# Altium project PCB_IHM_MS1.PrjPcb
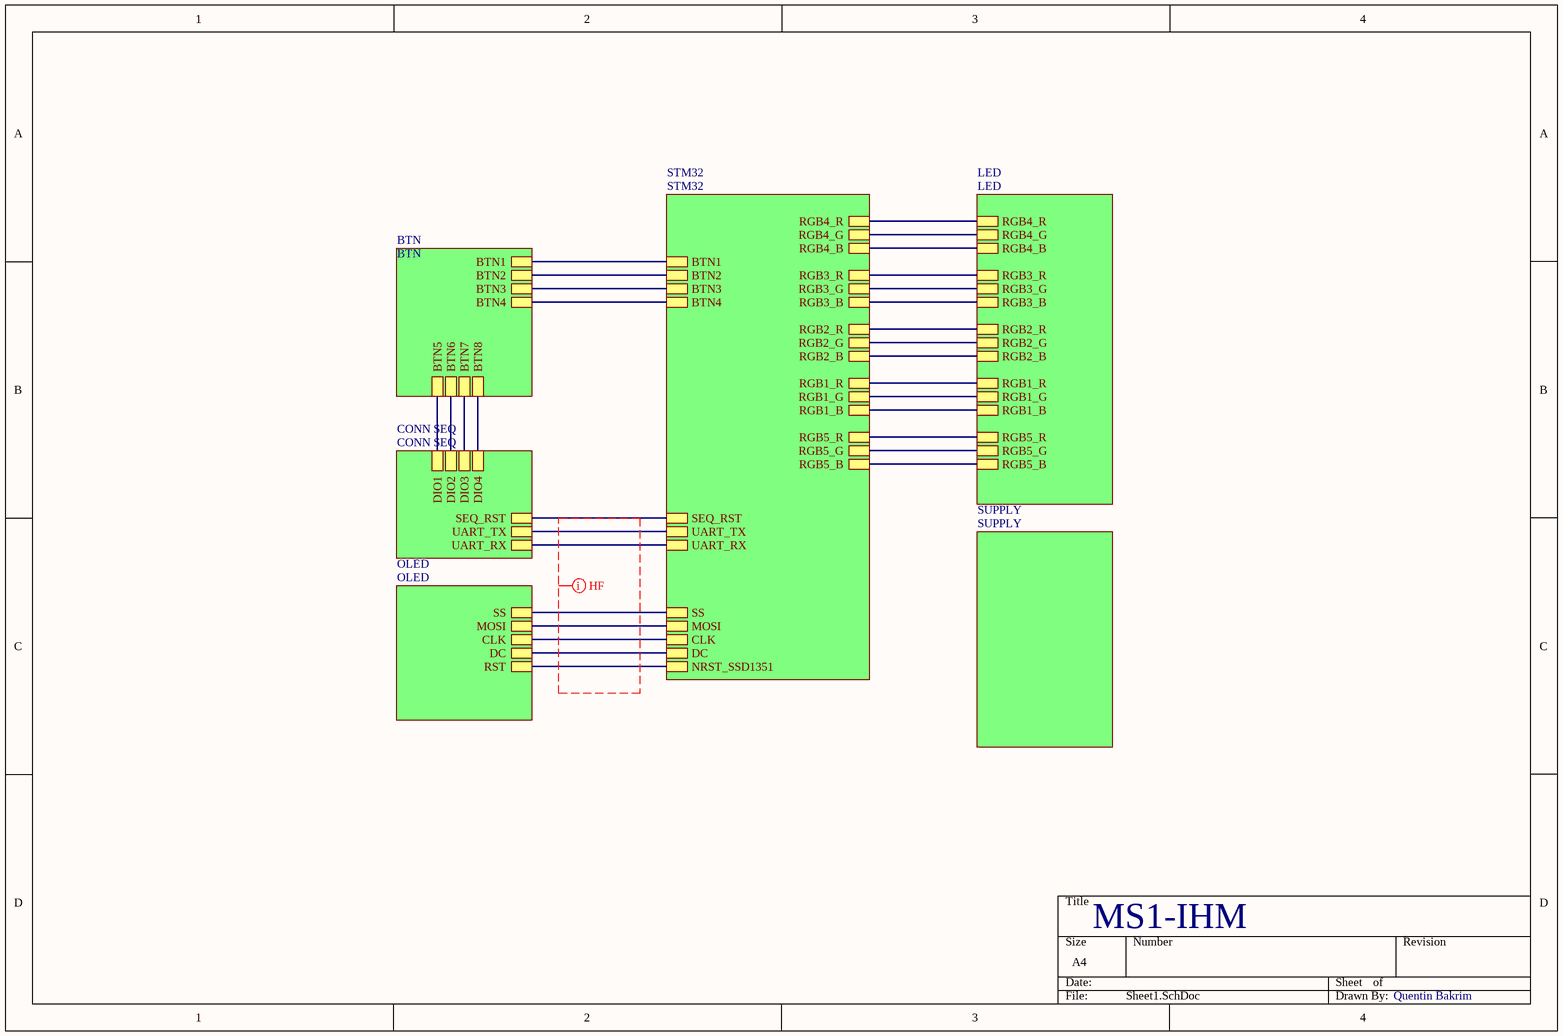
[diagram p0: Sheet1.SchDoc]
7 sheets, 91 parts. Net scope: hierarchical (ports join the sheet entries above them; power ports are global).
Board file: IHM.PcbDoc
Sheets:
  Sheet1.SchDoc
    BTN = BTN.SchDoc
    STM32 = STM32.SchDoc
    LED = LED.SchDoc
    OLED = OLED.SchDoc
    SUPPLY = SUPPLY.SchDoc
    CONN SEQ = CONN SEQ.SchDoc

## Sheet Sheet1.SchDoc
size A4; SheetNumber: 1; SheetTotal: 7

### Sub-sheets
BTN = BTN: BTN6, BTN1, BTN5, BTN4, BTN3, BTN2, BTN7, BTN8
CONN SEQ = CONN SEQ: UART_RX, DIO4, UART_TX, DIO3, DIO2, DIO1, SEQ_RST
LED = LED: RGB4_R, RGB4_B, RGB3_G, RGB5_B, RGB5_R, RGB5_G, RGB4_G, RGB1_B, RGB3_R, RGB1_R, RGB2_G, RGB2_R, RGB1_G, RGB3_B, RGB2_B
OLED = OLED: RST, SS, CLK, DC, MOSI
STM32 = STM32: RGB4_R, RGB4_B, RGB3_G, BTN1, BTN2, RGB5_B, RGB5_R, BTN3, RGB5_G, RGB4_G, BTN4, UART_RX, RGB1_B, RGB3_R, RGB1_R, RGB2_G, UART_TX, RGB2_R, RGB1_G, RGB3_B, RGB2_B, SS, MOSI, CLK, DC, NRST_SSD1351, SEQ_RST
SUPPLY = SUPPLY: no entries

### Nets
NetC1_1: sheet BTN/BTN1, sheet STM32/BTN1
NetC2_1: sheet BTN/BTN3, sheet STM32/BTN3
NetC3_1: sheet BTN/BTN5, sheet CONN SEQ/DIO1
NetC4_1: sheet BTN/BTN2, sheet STM32/BTN2
NetC5_1: sheet BTN/BTN4, sheet STM32/BTN4
NetC6_1: sheet BTN/BTN6, sheet CONN SEQ/DIO2
NetC7_1: sheet BTN/BTN7, sheet CONN SEQ/DIO3
NetC8_1: sheet BTN/BTN8, sheet CONN SEQ/DIO4
NetP1_3: sheet STM32/MOSI, sheet OLED/MOSI
NetP1_4: sheet STM32/CLK, sheet OLED/CLK
NetP1_5: sheet STM32/SS, sheet OLED/SS
NetP1_6: sheet STM32/DC, sheet OLED/DC
NetP1_7: sheet STM32/NRST_SSD1351, sheet OLED/RST
NetP2_6: sheet STM32/UART_TX, sheet CONN SEQ/UART_TX
NetP2_8: sheet STM32/UART_RX, sheet CONN SEQ/UART_RX
NetP2_10: sheet STM32/SEQ_RST, sheet CONN SEQ/SEQ_RST
NetR31_1: sheet STM32/RGB1_B, sheet LED/RGB1_B
NetR32_1: sheet STM32/RGB1_R, sheet LED/RGB1_R
NetR33_1: sheet STM32/RGB1_G, sheet LED/RGB1_G
NetR34_1: sheet STM32/RGB2_B, sheet LED/RGB2_B
NetR35_1: sheet STM32/RGB2_R, sheet LED/RGB2_R
NetR36_1: sheet STM32/RGB2_G, sheet LED/RGB2_G
NetR37_1: sheet STM32/RGB3_B, sheet LED/RGB3_B
NetR38_1: sheet STM32/RGB3_R, sheet LED/RGB3_R
NetR39_1: sheet STM32/RGB3_G, sheet LED/RGB3_G
NetR40_1: sheet STM32/RGB4_B, sheet LED/RGB4_B
NetR41_1: sheet STM32/RGB4_R, sheet LED/RGB4_R
NetR42_1: sheet STM32/RGB4_G, sheet LED/RGB4_G
NetR43_1: sheet STM32/RGB5_B, sheet LED/RGB5_B
NetR44_1: sheet STM32/RGB5_R, sheet LED/RGB5_R
NetR45_1: sheet STM32/RGB5_G, sheet LED/RGB5_G

### Layout directives
net class HF: (no net found under the mark)

### Notes on the sheet
- MS1-IHM
- Quentin Bakrim

## Sheet BTN.SchDoc
size A3; SheetNumber: 2; SheetTotal: 7
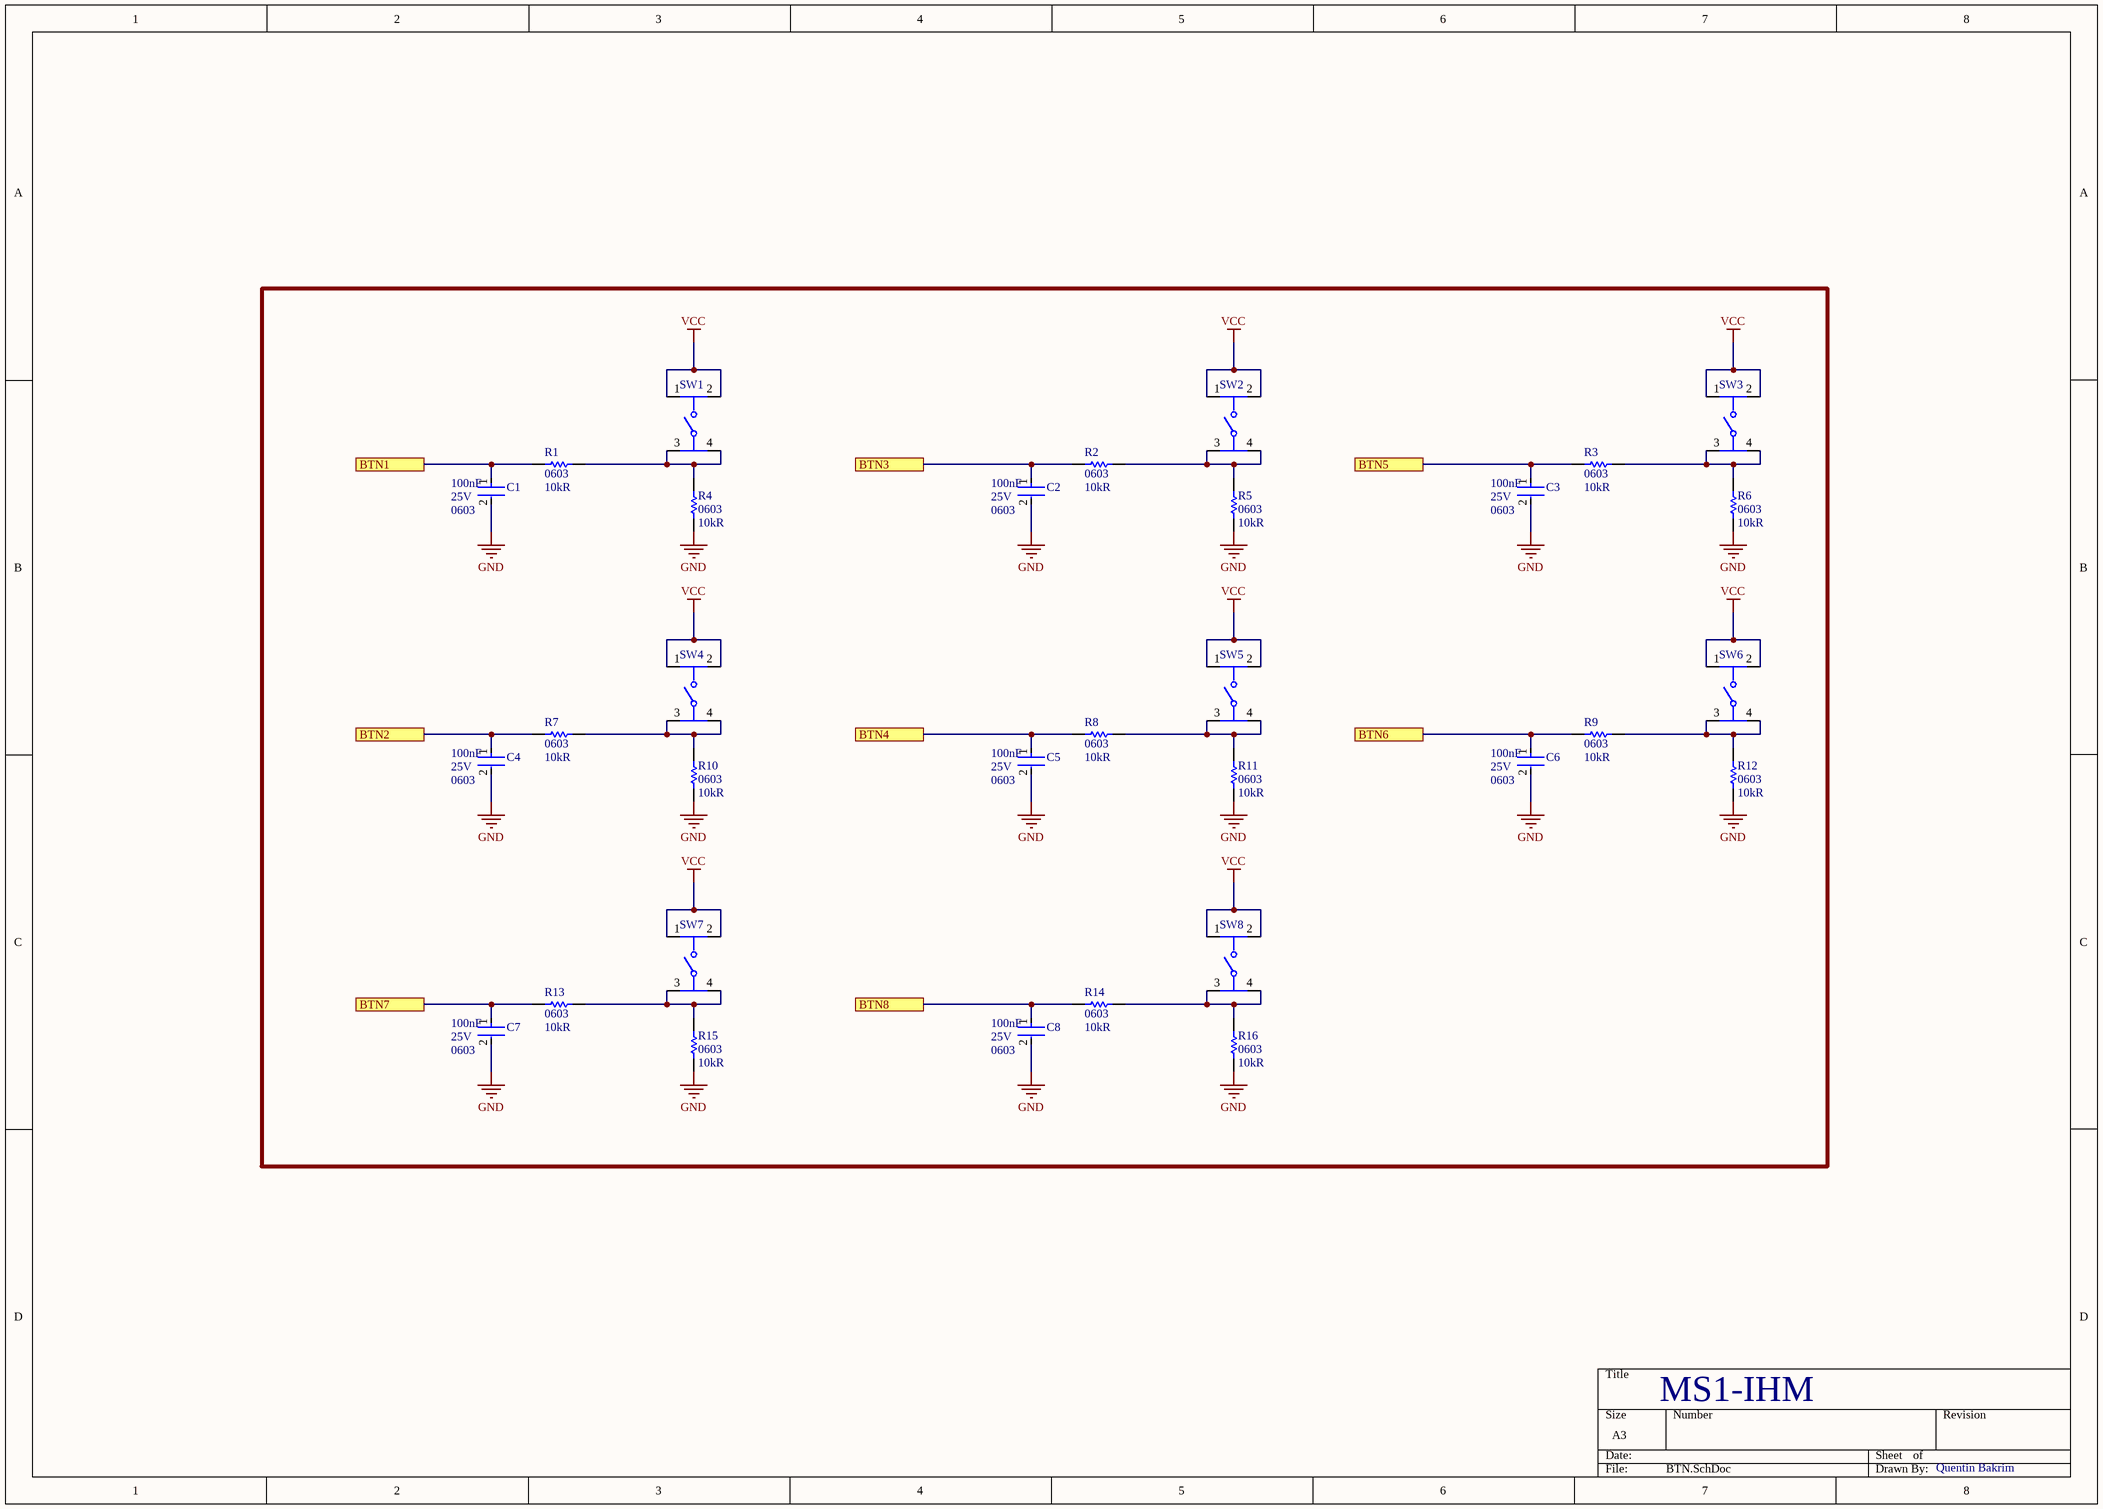
[diagram p1: BTN.SchDoc]

### Parts
C1  Case/Package: 0603  Voltage Rating (DC): 25V  Capacitance: 100nF  [FP-CGA3E-0_3-0_1-MFG]  (hidden comment: CGA3E2X7R1E104K080AA)
C2  Case/Package: 0603  Voltage Rating (DC): 25V  Capacitance: 100nF  [FP-CGA3E-0_3-0_1-MFG]  (hidden comment: CGA3E2X7R1E104K080AA)
C3  Case/Package: 0603  Voltage Rating (DC): 25V  Capacitance: 100nF  [FP-CGA3E-0_3-0_1-MFG]  (hidden comment: CGA3E2X7R1E104K080AA)
C4  Case/Package: 0603  Voltage Rating (DC): 25V  Capacitance: 100nF  [FP-CGA3E-0_3-0_1-MFG]  (hidden comment: CGA3E2X7R1E104K080AA)
C5  Case/Package: 0603  Voltage Rating (DC): 25V  Capacitance: 100nF  [FP-CGA3E-0_3-0_1-MFG]  (hidden comment: CGA3E2X7R1E104K080AA)
C6  Case/Package: 0603  Voltage Rating (DC): 25V  Capacitance: 100nF  [FP-CGA3E-0_3-0_1-MFG]  (hidden comment: CGA3E2X7R1E104K080AA)
C7  Case/Package: 0603  Voltage Rating (DC): 25V  Capacitance: 100nF  [FP-CGA3E-0_3-0_1-MFG]  (hidden comment: CGA3E2X7R1E104K080AA)
C8  Case/Package: 0603  Voltage Rating (DC): 25V  Capacitance: 100nF  [FP-CGA3E-0_3-0_1-MFG]  (hidden comment: CGA3E2X7R1E104K080AA)
R1  Case\/Package: 0603  Resistance: 10kR  [RESC1609X55X30LL15T15]  (hidden comment: ERJ3EKF1002V)
R2  Case\/Package: 0603  Resistance: 10kR  [RESC1609X55X30LL15T15]  (hidden comment: ERJ3EKF1002V)
R3  Case\/Package: 0603  Resistance: 10kR  [RESC1609X55X30LL15T15]  (hidden comment: ERJ3EKF1002V)
R4  Case\/Package: 0603  Resistance: 10kR  [RESC1609X55X30LL15T15]  (hidden comment: ERJ3EKF1002V)
R5  Case\/Package: 0603  Resistance: 10kR  [RESC1609X55X30LL15T15]  (hidden comment: ERJ3EKF1002V)
R6  Case\/Package: 0603  Resistance: 10kR  [RESC1609X55X30LL15T15]  (hidden comment: ERJ3EKF1002V)
R7  Case\/Package: 0603  Resistance: 10kR  [RESC1609X55X30LL15T15]  (hidden comment: ERJ3EKF1002V)
R8  Case\/Package: 0603  Resistance: 10kR  [RESC1609X55X30LL15T15]  (hidden comment: ERJ3EKF1002V)
R9  Case\/Package: 0603  Resistance: 10kR  [RESC1609X55X30LL15T15]  (hidden comment: ERJ3EKF1002V)
R10  Case\/Package: 0603  Resistance: 10kR  [RESC1609X55X30LL15T15]  (hidden comment: ERJ3EKF1002V)
R11  Case\/Package: 0603  Resistance: 10kR  [RESC1609X55X30LL15T15]  (hidden comment: ERJ3EKF1002V)
R12  Case\/Package: 0603  Resistance: 10kR  [RESC1609X55X30LL15T15]  (hidden comment: ERJ3EKF1002V)
R13  Case\/Package: 0603  Resistance: 10kR  [RESC1609X55X30LL15T15]  (hidden comment: ERJ3EKF1002V)
R14  Case\/Package: 0603  Resistance: 10kR  [RESC1609X55X30LL15T15]  (hidden comment: ERJ3EKF1002V)
R15  Case\/Package: 0603  Resistance: 10kR  [RESC1609X55X30LL15T15]  (hidden comment: ERJ3EKF1002V)
R16  Case\/Package: 0603  Resistance: 10kR  [RESC1609X55X30LL15T15]  (hidden comment: ERJ3EKF1002V)
SW1  PTS645SM43SMTR92LFS  [FP-PTS645SM43SMTR92LFS-MFG]  (value not drawn)
SW2  PTS645SM43SMTR92LFS  [FP-PTS645SM43SMTR92LFS-MFG]  (value not drawn)
SW3  PTS645SM43SMTR92LFS  [FP-PTS645SM43SMTR92LFS-MFG]  (value not drawn)
SW4  PTS645SM43SMTR92LFS  [FP-PTS645SM43SMTR92LFS-MFG]  (value not drawn)
SW5  PTS645SM43SMTR92LFS  [FP-PTS645SM43SMTR92LFS-MFG]  (value not drawn)
SW6  PTS645SM43SMTR92LFS  [FP-PTS645SM43SMTR92LFS-MFG]  (value not drawn)
SW7  PTS645SM43SMTR92LFS  [FP-PTS645SM43SMTR92LFS-MFG]  (value not drawn)
SW8  PTS645SM43SMTR92LFS  [FP-PTS645SM43SMTR92LFS-MFG]  (value not drawn)

### Ports
BTN1, BTN2, BTN3, BTN4, BTN5, BTN6, BTN7, BTN8

### Nets
GND: C1.2 C2.2 C3.2 C4.2 C5.2 C6.2 C7.2 C8.2 R4.1 R5.1 R6.1 R10.1 R11.1 R12.1 R15.1 R16.1
VCC: SW1.1 SW1.2 SW2.1 SW2.2 SW3.1 SW3.2 SW4.1 SW4.2 SW5.1 SW5.2 SW6.1 SW6.2 SW7.1 SW7.2 SW8.1 SW8.2
NetC1_1: C1.1 R1.2 ; port BTN1
NetC2_1: C2.1 R2.2 ; port BTN3
NetC3_1: C3.1 R3.2 ; port BTN5
NetC4_1: C4.1 R7.2 ; port BTN2
NetC5_1: C5.1 R8.2 ; port BTN4
NetC6_1: C6.1 R9.2 ; port BTN6
NetC7_1: C7.1 R13.2 ; port BTN7
NetC8_1: C8.1 R14.2 ; port BTN8
NetR1_1: R1.1 R4.2 SW1.3 SW1.4
NetR2_1: R2.1 R5.2 SW2.3 SW2.4
NetR3_1: R3.1 R6.2 SW3.3 SW3.4
NetR7_1: R7.1 R10.2 SW4.3 SW4.4
NetR8_1: R8.1 R11.2 SW5.3 SW5.4
NetR9_1: R9.1 R12.2 SW6.3 SW6.4
NetR13_1: R13.1 R15.2 SW7.3 SW7.4
NetR14_1: R14.1 R16.2 SW8.3 SW8.4

### Notes on the sheet
- MS1-IHM
- Quentin Bakrim

### Library data of the parts
C1-C8 = CMP-08246-002186-1: Cap Ceramic 100nF 25V X7R 10% Pad SMD 0603 +125°C Automotive T/R; Manufacturer: TDK; Composition: Ceramic; Dielectric: X7R; Ratings: AEC-Q200; Length: 1.6mm; REACH SVHC: No SVHC; Width: 0.031inch; Packaging: Tape and Reel; Height: 0.8mm; Termination: SMD/SMT; Max Operating Temperature: 125°C; Thickness: 0.035inch; Case Code (Metric): 1608; Lead Free: Lead Free; Mount: Surface Mount; Voltage Rating: 25V; Tolerance: 10%; Weight: 7.1E-05oz; Min Operating Temperature: -55°C; Package Quantity: 1; Depth: 0.8mm; Case Code (Imperial): 0603; Supplier 1: Digi-Key; Supplier Part Number 1: 445-5667-1-ND; Manufacturer Part Number: CGA3E2X7R1E104K080AA; RoHS: Yes; Category: Ceramic Capacitors; Stock 1: 436091; Pricing 1: 1=0,10000, 10=0,05400, 50=0,02960, 100=0,02430, 500=0,01732, 1000=0,01361 (USD); Series: CGA; Resistor Type: Ceramic; RoHS Compliant: Yes; ComponentLink1URL: https://datasheet.ciiva.com/24220/cga3e2x7r1e104k080aa-265934-24220022.pdf?src-supplier=Mouser; ComponentLink1Description: https://datasheet.ciiva.com/24220/cga3e2x7r1e104k080aa-265934-24220022.pdf?src-supplier=Mouser; ComponentLink2URL: https://datasheet.ciiva.com/22725/1735392-22725638.pdf?src-supplier=Element14; ComponentLink2Description: https://datasheet.ciiva.com/22725/1735392-22725638.pdf?src-supplier=Element14; ComponentLink3URL: https://datasheet.ciiva.com/22725/1735392-22725639.pdf?src-supplier=Element14; ComponentLink3Description: https://datasheet.ciiva.com/22725/1735392-22725639.pdf?src-supplier=Element14; ComponentLink4URL: https://datasheet.ciiva.com/16427/mlccspec-automotive-general-midvoltage-en-16427320.pdf?src-supplier=Future+Electronics; ComponentLink4Description: https://datasheet.ciiva.com/16427/mlccspec-automotive-general-midvoltage-en-16427320.pdf?src-supplier=Future+Electronics; ComponentLink5URL: https://datasheet.ciiva.com/23803/1735392-23803082.pdf?src-supplier=Newark; ComponentLink5Description: https://datasheet.ciiva.com/23803/1735392-23803082.pdf?src-supplier=Newark
R1-R16 = CMP-1012-00623-3: Chip Resistor, 10 KOhm, +/- 1%, 0.1 W, -55 to 155 degC, 0603 (1608 Metric), RoHS, Tape and Reel; Manufacturer: Panasonic; Voltage Rating: 75V; Power Rating: 100mW; Temperature Coefficient: 100ppm\/degreesC; Number of Pins: 2; Package Reference: 603; Depth: 0.8mm; Mount: SurfaceMount; Package Description: 2-Pin Surface Mount Device, Body 1.6 x 0.85 mm; Datasheet Version: 02/2017; Length: 1.6mm; Lead Free: LeadFree; Height: 0.45mm; Number of Terminations: 2; Max Power Dissipation: 100mW; Min Operating Temperature: -55degC; Datasheet URL: https://industrial.panasonic.com/cdbs/www-data/pdf/RDA0000/AOA0000C304.pdf; Termination: SMD/SMT; Case Code (Metric): 1608; Case Code (Imperial): 0603; Tolerance: 1%; Max Operating Temperature: 155degC; RoHSCompliant: true; Voltage Rating (DC): 75V; Radiation Hardening: No; Packaging: TapeandReel; Composition: ThickFilm; Mounting Technology: SurfaceMount; Manufacturer URL: http://www.panasonic.com/; Width: 0.031inch; REACH SVHC: NoSVHC; Contact Plating: Tin; Military Standard: Not; Package Quantity: 1
SW1-SW8 = CMP-2000-05160-2: Contact Resistance: 100mR; Throw Configuration: SPST; Illumination Type: Non-Illuminated; Mechanical Life: 100000Cycles; Voltage Rating (DC): 12V; Current Rating: 50mA; Switch Function: Off-Mom; Actuator Length: 0.85mm; Actuator Material: Nylon; Actuator Type: Standard; Operating Force: 160gf; Min Operating Temperature: -20°C; REACH SVHC: No SVHC; Termination: Gull Wing; Case/Package: SMD/SMT; Packaging: Tape and Reel; Mount: Surface Mount; Orientation: Straight; Lead Free: Lead Free; Contact Material: Silver; Color: Black; Max Current Rating: 50mA; Contact Plating: Silver; Depth: 9mm; Package Quantity: 1; Max Voltage Rating (DC): 12V; Length: 6mm; Max Operating Temperature: 60°C

## Sheet STM32.SchDoc
size A3; SheetNumber: 3; SheetTotal: 7
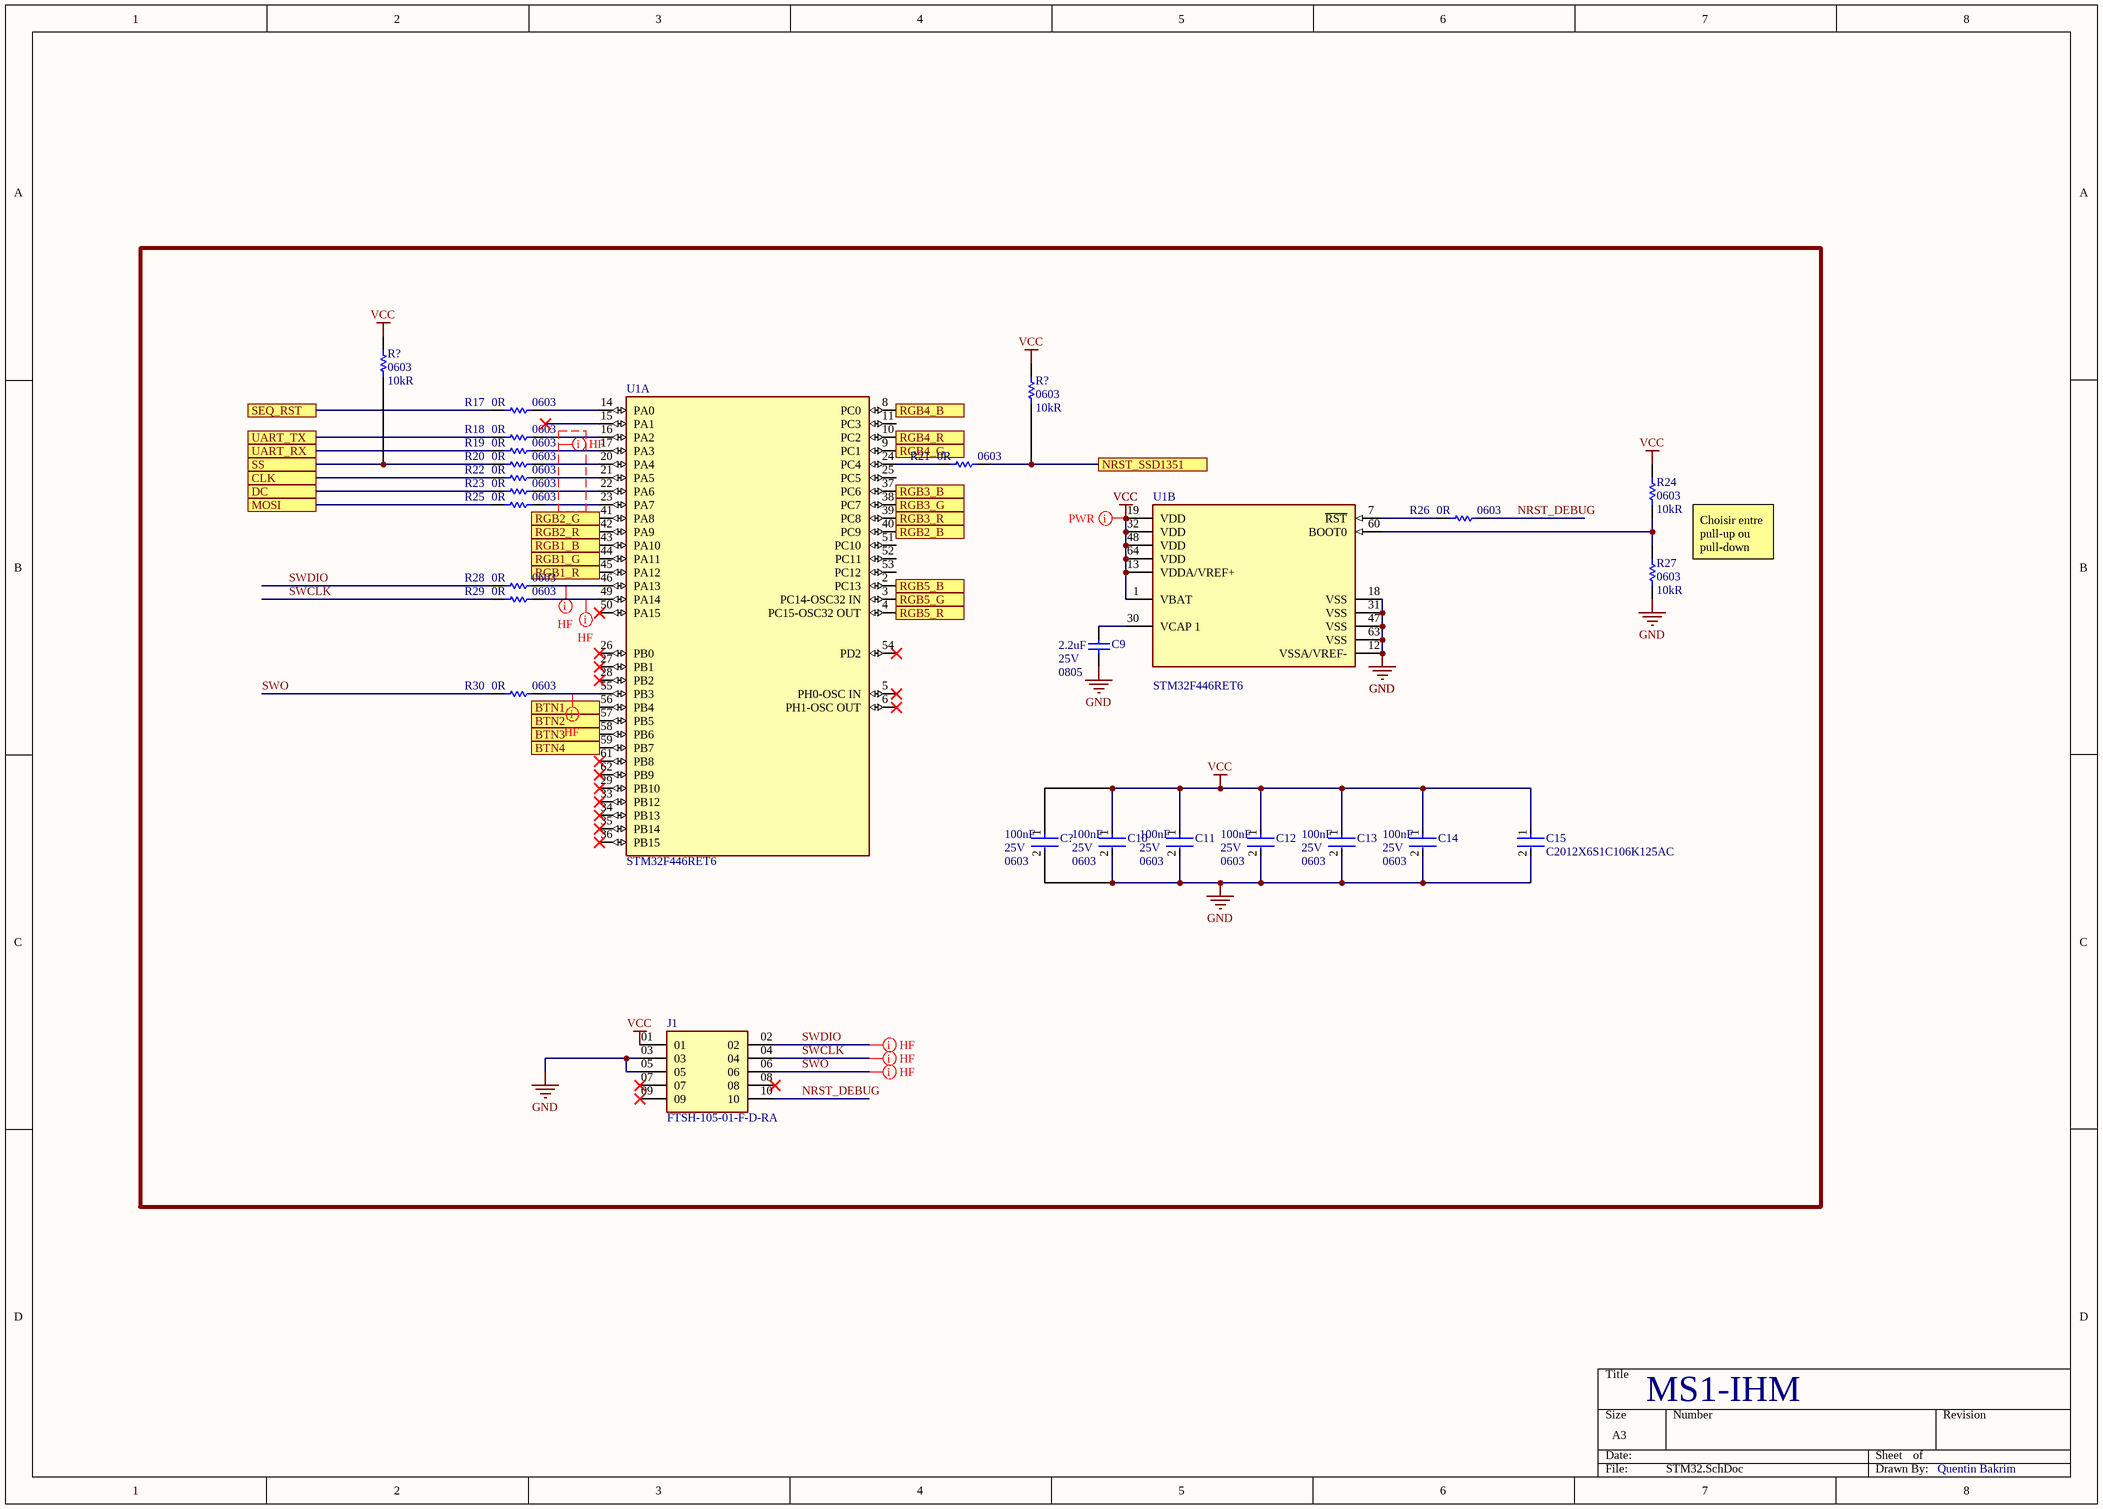
[diagram p2: STM32.SchDoc]

### Parts
(Parts that share a designator on the sheet are numbered #1, #2 ... from top to bottom, then left to right.)
C9  Case/Package: 0805  Capacitance: 2.2uF  Voltage Rating: 25V  [CAPC2013X140X45NL15T25]  (hidden comment: GRM21BR71E225KA73L)
C10  Case/Package: 0603  Voltage Rating (DC): 25V  Capacitance: 100nF  [FP-CGA3E-0_3-0_1-MFG]  (hidden comment: CGA3E2X7R1E104K080AA)
C11  Case/Package: 0603  Voltage Rating (DC): 25V  Capacitance: 100nF  [FP-CGA3E-0_3-0_1-MFG]  (hidden comment: CGA3E2X7R1E104K080AA)
C12  Case/Package: 0603  Voltage Rating (DC): 25V  Capacitance: 100nF  [FP-CGA3E-0_3-0_1-MFG]  (hidden comment: CGA3E2X7R1E104K080AA)
C13  Case/Package: 0603  Voltage Rating (DC): 25V  Capacitance: 100nF  [FP-CGA3E-0_3-0_1-MFG]  (hidden comment: CGA3E2X7R1E104K080AA)
C14  Case/Package: 0603  Voltage Rating (DC): 25V  Capacitance: 100nF  [FP-CGA3E-0_3-0_1-MFG]  (hidden comment: CGA3E2X7R1E104K080AA)
C15  C2012X6S1C106K125AC  [FP-C2012-125-0_2-MFG]
C?  Case/Package: 0603  Voltage Rating (DC): 25V  Capacitance: 100nF  [FP-CGA3E-0_3-0_1-MFG]  (hidden comment: CGA3E2X7R1E104K080AA)
J1  FTSH-105-01-F-D-RA  [SAMTEC_FTSH-105-01-F-D-RA]
R17  PackageReference: 0603  Resistor: 0R  [RESC1609X50X30NL8T20]  (hidden comment: CRCW06030000Z0EA)
R18  PackageReference: 0603  Resistor: 0R  [RESC1609X50X30NL8T20]  (hidden comment: CRCW06030000Z0EA)
R19  PackageReference: 0603  Resistor: 0R  [RESC1609X50X30NL8T20]  (hidden comment: CRCW06030000Z0EA)
R20  PackageReference: 0603  Resistor: 0R  [RESC1609X50X30NL8T20]  (hidden comment: CRCW06030000Z0EA)
R21  PackageReference: 0603  Resistor: 0R  [RESC1609X50X30NL8T20]  (hidden comment: CRCW06030000Z0EA)
R22  PackageReference: 0603  Resistor: 0R  [RESC1609X50X30NL8T20]  (hidden comment: CRCW06030000Z0EA)
R23  PackageReference: 0603  Resistor: 0R  [RESC1609X50X30NL8T20]  (hidden comment: CRCW06030000Z0EA)
R24  Case\/Package: 0603  Resistance: 10kR  [RESC1609X55X30LL15T15]  (hidden comment: ERJ3EKF1002V)
R25  PackageReference: 0603  Resistor: 0R  [RESC1609X50X30NL8T20]  (hidden comment: CRCW06030000Z0EA)
R26  PackageReference: 0603  Resistor: 0R  [RESC1609X50X30NL8T20]  (hidden comment: CRCW06030000Z0EA)
R27  Case\/Package: 0603  Resistance: 10kR  [RESC1609X55X30LL15T15]  (hidden comment: ERJ3EKF1002V)
R28  PackageReference: 0603  Resistor: 0R  [RESC1609X50X30NL8T20]  (hidden comment: CRCW06030000Z0EA)
R29  PackageReference: 0603  Resistor: 0R  [RESC1609X50X30NL8T20]  (hidden comment: CRCW06030000Z0EA)
R30  PackageReference: 0603  Resistor: 0R  [RESC1609X50X30NL8T20]  (hidden comment: CRCW06030000Z0EA)
R?#1  Case\/Package: 0603  Resistance: 10kR  [RESC1609X55X30LL15T15]  (hidden comment: ERJ3EKF1002V)
R?#2  Case\/Package: 0603  Resistance: 10kR  [RESC1609X55X30LL15T15]  (hidden comment: ERJ3EKF1002V)
U1  STM32F446RET6  [FP-LQFP64-5W-MFG]  (parts A,B of 2)

### Ports
BTN1, BTN2, BTN3, BTN4, CLK, DC, MOSI, NRST_SSD1351, RGB1_B, RGB1_G, RGB1_R, RGB2_B, RGB2_G, RGB2_R, RGB3_B, RGB3_G, RGB3_R, RGB4_B, RGB4_G, RGB4_R, RGB5_B, RGB5_G, RGB5_R, SEQ_RST, SS, UART_RX, UART_TX

### Nets
GND: C9.1 C10.2 C11.2 C12.2 C13.2 C14.2 C15.2 C?.2 J1.03 J1.05 R27.1 U1.12(VSSA/VREF-) U1.18(VSS) U1.31(VSS) U1.47(VSS) U1.63(VSS)
VCC: C10.1 C11.1 C12.1 C13.1 C14.1 C15.1 C?.1 J1.01 R24.2 R?#1.2 R?#2.2 U1.1(VBAT) U1.13(VDDA/VREF+) U1.19(VDD) U1.32(VDD) U1.48(VDD) U1.64(VDD)
NRST_DEBUG: J1.10 R26.2
SWCLK: J1.04 R29.1
SWDIO: J1.02 R28.1
SWO: J1.06 R30.1
NetC1_1: U1.56(PB4) ; port BTN1
NetC2_1: U1.58(PB6) ; port BTN3
NetC4_1: U1.57(PB5) ; port BTN2
NetC5_1: U1.59(PB7) ; port BTN4
NetC9_2: C9.2 U1.30(VCAP_1)
NetP1_3: R25.1 ; port MOSI
NetP1_4: R22.1 ; port CLK
NetP1_5: R20.1 R?#1.1 ; port SS
NetP1_6: R23.1 ; port DC
NetP1_7: R21.2 R?#2.1 ; port NRST_SSD1351
NetP2_6: R18.1 ; port UART_TX
NetP2_8: R19.1 ; port UART_RX
NetP2_10: R17.1 ; port SEQ_RST
NetR17_2: R17.2 U1.14(PA0)
NetR18_2: R18.2 U1.16(PA2)
NetR19_2: R19.2 U1.17(PA3)
NetR20_2: R20.2 U1.20(PA4)
NetR21_1: R21.1 U1.24(PC4)
NetR22_2: R22.2 U1.21(PA5)
NetR23_2: R23.2 U1.22(PA6)
NetR24_1: R24.1 R27.2 U1.60(BOOT0)
NetR25_2: R25.2 U1.23(PA7)
NetR26_1: R26.1 U1.7(~{RST})
NetR28_2: R28.2 U1.46(PA13)
NetR29_2: R29.2 U1.49(PA14)
NetR30_2: R30.2 U1.55(PB3)
NetR31_1: U1.43(PA10) ; port RGB1_B
NetR32_1: U1.45(PA12) ; port RGB1_R
NetR33_1: U1.44(PA11) ; port RGB1_G
NetR34_1: U1.40(PC9) ; port RGB2_B
NetR35_1: U1.42(PA9) ; port RGB2_R
NetR36_1: U1.41(PA8) ; port RGB2_G
NetR37_1: U1.37(PC6) ; port RGB3_B
NetR38_1: U1.39(PC8) ; port RGB3_R
NetR39_1: U1.38(PC7) ; port RGB3_G
NetR40_1: U1.8(PC0) ; port RGB4_B
NetR41_1: U1.10(PC2) ; port RGB4_R
NetR42_1: U1.9(PC1) ; port RGB4_G
NetR43_1: U1.2(PC13) ; port RGB5_B
NetR44_1: U1.4(PC15-OSC32_OUT) ; port RGB5_R
NetR45_1: U1.3(PC14-OSC32_IN) ; port RGB5_G

Not connected (* = marked no-connect by the designer): J1 07* 08* 09*; U1 5(PH0-OSC_IN)* 6(PH1-OSC_OUT)* 11(PC3) 15(PA1)* 25(PC5) 26(PB0)* 27(PB1)* 28(PB2)* 29(PB10)* 33(PB12)* 34(PB13)* 35(PB14)* 36(PB15)* 50(PA15)* 51(PC10) 52(PC11) 53(PC12) 54(PD2)* 61(PB8)* 62(PB9)*

### Layout directives
net class HF: (no net found under the mark), NetR28_2, NetR29_2, NetR30_2, SWCLK, SWDIO, SWO
net class PWR: VCC

### Notes on the sheet
- Choisir entre pull-up ou pull-down
- MS1-IHM
- Quentin Bakrim

### Library data of the parts
C9 = CMP-2007-03405-1: Manufacturer: Murata; Material: Ceramic; Tolerance: 10%; Dielectric: X7R; Part Number: GRM21BR71E225KA73L; Supplier 1: Arrow Electronics; Supplier Part Number 1: GRM21BR71E225KA73L; Manufacturer Part Number: GRM21BR71E225KA73L; RoHS: Yes; Category: Ceramic Capacitors; Stock 1: 12000; Pricing 1: 3000=0,15000, 6000=0,14850, 9000=0,14700, 12000=0,14550, 15000=0,14400, 24000=0,14250 (USD); Mount: Surface Mount; Case Code (Metric): 2012; Case Code (Imperial): 0805; Min Operating Temperature: -55°C; Max Operating Temperature: 125°C; Package Quantity: 1; Packaging: Tape and Reel; Voltage Rating (DC): 25V; Termination: SMD/SMT; Voltage: 25V; Length: 2mm; Width: 0.049inch; Height: 1.25mm; Thickness: 0.053inch; Depth: 1.25mm; Radiation Hardening: No; REACH SVHC: No SVHC; Lead Free: Lead Free; RoHS Compliant: Yes; ComponentLink1URL: https://datasheet.ciiva.com/34302/1858990-34302875.pdf?src-supplier=Jameco; ComponentLink1Description: https://datasheet.ciiva.com/34302/1858990-34302875.pdf?src-supplier=Jameco; ComponentLink2URL: https://datasheet.ciiva.com/140/product-140527.pdf?src-supplier=Digi-Key; ComponentLink2Description: https://datasheet.ciiva.com/140/product-140527.pdf?src-supplier=Digi-Key; ComponentLink3URL: https://datasheet.ciiva.com/2989/product-2989728.pdf?src-supplier=Avnet; ComponentLink3Description: https://datasheet.ciiva.com/2989/product-2989728.pdf?src-supplier=Avnet; ComponentLink4URL: https://datasheet.ciiva.com/3776/1141grm21br71e225ka7323-3776998.pdf?src-supplier=Arrow+Electronics; ComponentLink4Description: https://datasheet.ciiva.com/3776/1141grm21br71e225ka7323-3776998.pdf?src-supplier=Arrow+Electronics; ComponentLink5URL: https://datasheet.ciiva.com/29202/450858-da-01-de-vs-chip-kond-0805-2-2-uf-10pr-25-0v-x7r-29202678.pdf?src-supplier=Conrad; ComponentLink5Description: https://datasheet.ciiva.com/29202/450858-da-01-de-vs-chip-kond-0805-2-2-uf-10pr-25-0v-x7r-29202678.pdf?src-supplier=Conrad; ComponentLink6URL: https://datasheet.ciiva.com/29199/454778-da-01-en-vs-kondensator-0805-29199535.pdf?src-supplier=Conrad; ComponentLink6Description: https://datasheet.ciiva.com/29199/454778-da-01-en-vs-kondensator-0805-29199535.pdf?src-supplier=Conrad; ComponentLink7URL: https://datasheet.ciiva.com/14116/grmseries-highdielectrictype-eng-14116411.pdf?src-supplier=Distrelec; ComponentLink7Description: https://datasheet.ciiva.com/14116/grmseries-highdielectrictype-eng-14116411.pdf?src-supplier=Distrelec; ComponentLink8URL: https://datasheet.ciiva.com/7937/415307-7937706.pdf?src-supplier=Element14; ComponentLink8Description: https://datasheet.ciiva.com/7937/415307-7937706.pdf?src-supplier=Element14; ComponentLink9URL: https://datasheet.ciiva.com/140/product-140528.pdf?src-supplier=Digi-Key; ComponentLink9Description: https://datasheet.ciiva.com/140/product-140528.pdf?src-supplier=Digi-Key; ComponentLink10URL: https://datasheet.ciiva.com/140/product-140529.pdf?src-supplier=Digi-Key; ComponentLink10Description: https://datasheet.ciiva.com/140/product-140529.pdf?src-supplier=Digi-Key; ComponentLink11URL: https://datasheet.ciiva.com/16625/product-16625259.pdf?src-supplier=Avnet+Europe; ComponentLink11Description: https://datasheet.ciiva.com/16625/product-16625259.pdf?src-supplier=Avnet+Europe; ComponentLink12URL: https://datasheet.ciiva.com/2989/product-2989727.pdf?src-supplier=Avnet; ComponentLink12Description: https://datasheet.ciiva.com/2989/product-2989727.pdf?src-supplier=Avnet
C10-C14 C? = CMP-08246-002186-1: as C1 on sheet BTN; Composition: Ceramic; Dielectric: X7R; Ratings: AEC-Q200; Length: 1.6mm; REACH SVHC: No SVHC; Width: 0.031inch; Packaging: Tape and Reel; Height: 0.8mm; Termination: SMD/SMT; Max Operating Temperature: 125°C; Thickness: 0.035inch; Case Code (Metric): 1608; Lead Free: Lead Free; Mount: Surface Mount; Voltage Rating: 25V; Tolerance: 10%; Weight: 7.1E-05oz; Min Operating Temperature: -55°C; Package Quantity: 1; Depth: 0.8mm; Case Code (Imperial): 0603; Supplier 1: Digi-Key; Supplier Part Number 1: 445-5667-1-ND; Manufacturer Part Number: CGA3E2X7R1E104K080AA; RoHS: Yes; Category: Ceramic Capacitors; Stock 1: 436091; Pricing 1: 1=0,10000, 10=0,05400, 50=0,02960, 100=0,02430, 500=0,01732, 1000=0,01361 (USD); Series: CGA; Resistor Type: Ceramic; RoHS Compliant: Yes; ComponentLink1URL: https://datasheet.ciiva.com/24220/cga3e2x7r1e104k080aa-265934-24220022.pdf?src-supplier=Mouser; ComponentLink1Description: https://datasheet.ciiva.com/24220/cga3e2x7r1e104k080aa-265934-24220022.pdf?src-supplier=Mouser; ComponentLink2URL: https://datasheet.ciiva.com/22725/1735392-22725638.pdf?src-supplier=Element14; ComponentLink2Description: https://datasheet.ciiva.com/22725/1735392-22725638.pdf?src-supplier=Element14; ComponentLink3URL: https://datasheet.ciiva.com/22725/1735392-22725639.pdf?src-supplier=Element14; ComponentLink3Description: https://datasheet.ciiva.com/22725/1735392-22725639.pdf?src-supplier=Element14; ComponentLink4URL: https://datasheet.ciiva.com/16427/mlccspec-automotive-general-midvoltage-en-16427320.pdf?src-supplier=Future+Electronics; ComponentLink4Description: https://datasheet.ciiva.com/16427/mlccspec-automotive-general-midvoltage-en-16427320.pdf?src-supplier=Future+Electronics; ComponentLink5URL: https://datasheet.ciiva.com/23803/1735392-23803082.pdf?src-supplier=Newark; ComponentLink5Description: https://datasheet.ciiva.com/23803/1735392-23803082.pdf?src-supplier=Newark
C15 = CMP-08246-003655-1: Multilayer Ceramic Capacitors 10μF ±10% 16V X6S SMD 0805; Capacitance: 10uF; Contact Plating: Tin; Height: 1.25mm; Thickness: 0.057inch; Case Code (Metric): 2012; Dielectric Material: Ceramic; Tolerance: 10%; Depth: 1.25mm; Length: 2mm; Lead Free: Lead Free; RoHS Compliant: Yes; Case/Package: 0805; REACH SVHC: No SVHC; Construction: Flat; Voltage Rating: 16V; Max Operating Temperature: 105°C; Series: C; Width: 0.049inch; Voltage Rating (DC): 16V; Packaging: Tape and Reel; Package Quantity: 1; Min Operating Temperature: -55°C; Mount: Surface Mount; Dielectric: X6S; Case Code (Imperial): 0805
J1 = FTSH-105-01-F-D-RA: MF: {'manufacturer': u'Samtec'}; MP: FTSH-105-01-F-D-RA; Availability: Unavailable; Price: None; Value: *; Package: None
R17-R23 R25 R26 R28-R30 = CMP-2000-03816-5: Chip Resistor, 0 Ohm, Jumper, 100 mW, -55 to 155 degC, 0603 (1608 Metric), RoHS, Tape and Reel; Manufacturer: Vishay Semiconductor; Voltage Rating: 75 V; Package Quantity: 5000; DatasheetVersion: 06/2012; Min Operating Temperature: -55 degC; ComponentLink1URL: http://www.vishay.com/; Mounting Technology: Surface Mount; Height: 0.45 mm; ComponentLink1Description: Manufacturer URL; REACH SVHC: Unknown; Packaging: Tape and Reel; Max Operating Temperature: 155 degC; Mount: Surface Mount; ComponentLink2Description: Datasheet; PackageDescription: 2-Pin Surface Mount Device, Body 1.575 x 0.85 mm; Length: 1.55 mm; ComponentLink2URL: http://www.vishay.com/docs/20035/dcrcwe3.pdf; Pins: 2; RoHSCompliant: true
R24 R27 R?#1 R?#2 = CMP-1012-00623-3: as R1 on sheet BTN; Number of Pins: 2; Package Reference: 603; Depth: 0.8mm; Mount: SurfaceMount; Package Description: 2-Pin Surface Mount Device, Body 1.6 x 0.85 mm; Datasheet Version: 02/2017; Length: 1.6mm; Lead Free: LeadFree; Height: 0.45mm; Number of Terminations: 2; Max Power Dissipation: 100mW; Min Operating Temperature: -55degC; Datasheet URL: https://industrial.panasonic.com/cdbs/www-data/pdf/RDA0000/AOA0000C304.pdf; Termination: SMD/SMT; Case Code (Metric): 1608; Case Code (Imperial): 0603; Tolerance: 1%; Max Operating Temperature: 155degC; RoHSCompliant: true; Voltage Rating (DC): 75V; Radiation Hardening: No; Packaging: TapeandReel; Composition: ThickFilm; Mounting Technology: SurfaceMount; Manufacturer URL: http://www.panasonic.com/; Width: 0.031inch; REACH SVHC: NoSVHC; Contact Plating: Tin; Military Standard: Not; Package Quantity: 1
U1 = CMP-12105-000007-1: IC MCU 32BIT 512KB FLASH 64LQFP; Manufacturer: ST; Number Of Spi Channels: 4; Ram Size: 128KBytes; Standoff Height: 0.05mm; Number Of Uart Channels: 6; Number Of Pwm Channels: 32; Max Junction Temp: +105°C; Number Of I/Os: 50; Number Of Usb Channels: 2; Frequency: 180MHz; Number Of A/D Converters: 3; Max Supply Voltage: 3.6V; Number Of Adc Channels: 16; Interface: I2C,SPI,UART,USART,CAN,USB,LIN,IrDA,I2S,Other; Memory Size: 512KBytes; Number Of Timers/Counters: 14; Min Supply Voltage: 1.7V; Core Architecture: ARM Cortex-M4; Data Bus Width: 32bits; Number Of Cores: 1; Ambient Temperature Range Low: -40°C; ComponentLink2URL: https://www.st.com/en/microcontrollers-microprocessors/stm32f446re.html; Category: IC; Height: 1.6mm; Ipc Land Pattern Name: QFP50P1200X1200X160-64; Manufacturer Part Number: STM32F446RET6; Octopart: https://octopart.com/stm32f446ret6-stmicroelectronics-52642920; Temperature Range High: +105°C; Lead Free: Yes; Mouser Description: ARM Microcontrollers - MCU High-performance and DSP with FP, ARM Cortex-M4 MCU with 512 Kbytes Flash, 180 MHz CPU, Art Accelerator, SDRAM; Digikey Description: IC MCU 32BIT 512KB FLASH 64LQFP; Ambient Temperature Range High: +85°C; Number Of I2C Channels: 4; Memory Type: FLASH; RoHS: TRUE; Automotive: No; Device Class L1: Integrated Circuits (ICs); Temperature: -40°C to +105°C; Device Class L2: Embedded Processors and Controllers; Device Class L3: Microcontrollers; Temperature Range Low: -40°C; Package: LQFP64-5W; ComponentLink2Description: Datasheet

## Sheet LED.SchDoc
size A3; SheetNumber: 4; SheetTotal: 7
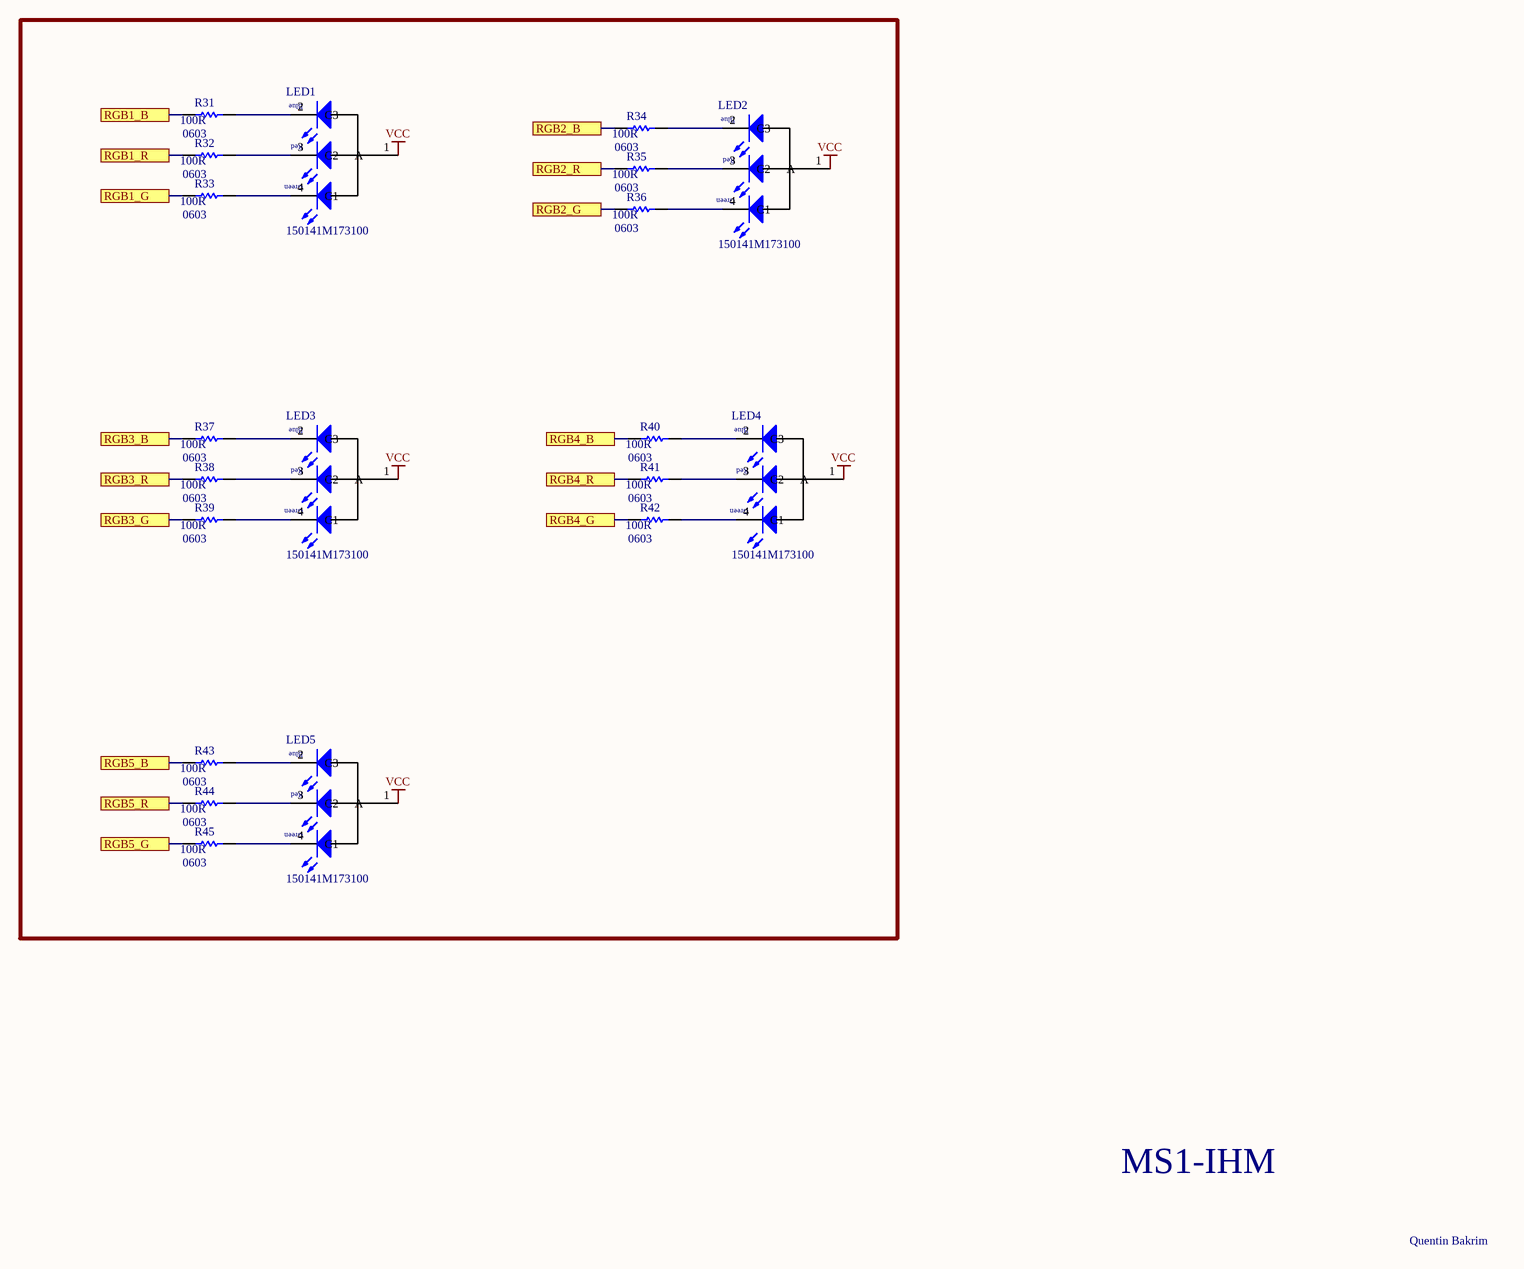
[diagram p3: LED.SchDoc]

### Parts
LED1  150141M173100  [3528_A]
LED2  150141M173100  [3528_A]
LED3  150141M173100  [3528_A]
LED4  150141M173100  [3528_A]
LED5  150141M173100  [3528_A]
R31  Case/Package: 0603  Resistance: 100R  [RESC1608X55X30LL15T15]  (hidden comment: ERJ-3EKF1000V)
R32  Case/Package: 0603  Resistance: 100R  [RESC1608X55X30LL15T15]  (hidden comment: ERJ-3EKF1000V)
R33  Case/Package: 0603  Resistance: 100R  [RESC1608X55X30LL15T15]  (hidden comment: ERJ-3EKF1000V)
R34  Case/Package: 0603  Resistance: 100R  [RESC1608X55X30LL15T15]  (hidden comment: ERJ-3EKF1000V)
R35  Case/Package: 0603  Resistance: 100R  [RESC1608X55X30LL15T15]  (hidden comment: ERJ-3EKF1000V)
R36  Case/Package: 0603  Resistance: 100R  [RESC1608X55X30LL15T15]  (hidden comment: ERJ-3EKF1000V)
R37  Case/Package: 0603  Resistance: 100R  [RESC1608X55X30LL15T15]  (hidden comment: ERJ-3EKF1000V)
R38  Case/Package: 0603  Resistance: 100R  [RESC1608X55X30LL15T15]  (hidden comment: ERJ-3EKF1000V)
R39  Case/Package: 0603  Resistance: 100R  [RESC1608X55X30LL15T15]  (hidden comment: ERJ-3EKF1000V)
R40  Case/Package: 0603  Resistance: 100R  [RESC1608X55X30LL15T15]  (hidden comment: ERJ-3EKF1000V)
R41  Case/Package: 0603  Resistance: 100R  [RESC1608X55X30LL15T15]  (hidden comment: ERJ-3EKF1000V)
R42  Case/Package: 0603  Resistance: 100R  [RESC1608X55X30LL15T15]  (hidden comment: ERJ-3EKF1000V)
R43  Case/Package: 0603  Resistance: 100R  [RESC1608X55X30LL15T15]  (hidden comment: ERJ-3EKF1000V)
R44  Case/Package: 0603  Resistance: 100R  [RESC1608X55X30LL15T15]  (hidden comment: ERJ-3EKF1000V)
R45  Case/Package: 0603  Resistance: 100R  [RESC1608X55X30LL15T15]  (hidden comment: ERJ-3EKF1000V)

### Ports
RGB1_B, RGB1_G, RGB1_R, RGB2_B, RGB2_G, RGB2_R, RGB3_B, RGB3_G, RGB3_R, RGB4_B, RGB4_G, RGB4_R, RGB5_B, RGB5_G, RGB5_R

### Nets
VCC: LED1.1(A) LED2.1(A) LED3.1(A) LED4.1(A) LED5.1(A)
NetLED1_2: LED1.2(C3) R31.2
NetLED1_3: LED1.3(C2) R32.2
NetLED1_4: LED1.4(C1) R33.2
NetLED2_2: LED2.2(C3) R34.2
NetLED2_3: LED2.3(C2) R35.2
NetLED2_4: LED2.4(C1) R36.2
NetLED3_2: LED3.2(C3) R37.2
NetLED3_3: LED3.3(C2) R38.2
NetLED3_4: LED3.4(C1) R39.2
NetLED4_2: LED4.2(C3) R40.2
NetLED4_3: LED4.3(C2) R41.2
NetLED4_4: LED4.4(C1) R42.2
NetLED5_2: LED5.2(C3) R43.2
NetLED5_3: LED5.3(C2) R44.2
NetLED5_4: LED5.4(C1) R45.2
NetR31_1: R31.1 ; port RGB1_B
NetR32_1: R32.1 ; port RGB1_R
NetR33_1: R33.1 ; port RGB1_G
NetR34_1: R34.1 ; port RGB2_B
NetR35_1: R35.1 ; port RGB2_R
NetR36_1: R36.1 ; port RGB2_G
NetR37_1: R37.1 ; port RGB3_B
NetR38_1: R38.1 ; port RGB3_R
NetR39_1: R39.1 ; port RGB3_G
NetR40_1: R40.1 ; port RGB4_B
NetR41_1: R41.1 ; port RGB4_R
NetR42_1: R42.1 ; port RGB4_G
NetR43_1: R43.1 ; port RGB5_B
NetR44_1: R44.1 ; port RGB5_R
NetR45_1: R45.1 ; port RGB5_G

### Notes on the sheet
- MS1-IHM
- Quentin Bakrim
- (in symbol CMP-1431-00001-1) Blue; Red; Green

### Library data of the parts
LED1-LED5 = CMP-1431-00001-1: SMD Full-Color Top LED, WL-SFTW, Red & Green & Blue; Manufacturer: Wuerth Elektronik; PackageReference: 3528_A; PartNumber: 150141M173100; ComponentLink2Description: Datasheet; ComponentLink1URL: http://www.we-online.com; Color: Red & Green & Blue; ComponentLink1Description: Manufacturer URL; ComponentLink2URL: http://katalog.we-online.com/led/datasheet/150141M173100.pdf
R31-R45 = CMP-2000-00179-1: Manufacturer: Panasonic; Manufacturer Part Number: ERJ3EKF1000V; Tolerance: 1%; Power Rating: 100mW; Voltage Rating: 75V; Temperature Coefficient: 100ppm/°C; Part Number: ERJ-3EKF1000V; Supplier 1: RSComponents; Supplier Part Number 1: 1755733; RoHS: Yes; Category: Chip SMD Resistors; Stock 1: 30000; Pricing 1: 5000=0,01000, 10000=0,00800, 15000=0,00800, 20000=0,00800, 5000=0,00700, 10000=0,00600, 15000=0,00600, 20000=0,00600 (USD); Mount: Surface Mount; Number of Pins: 2; Case Code (Imperial): 0603; Case Code (Metric): 1608; Weight: 7.1E-05oz; Contact Plating: Tin; Size Code: 0603; Min Operating Temperature: -55°C; Max Operating Temperature: 155°C; Packaging: Tape and Reel; Termination: SMD/SMT; Resistor Type: Thick Film; Number of Terminations: 2; Series: ERJ; Package Quantity: 5000; Max Power Dissipation: 100mW; Voltage Rating (DC): 75V; Resistance Tolerance: 1%; Construction: Rectangular; Features: Automotive AEC-Q200; Length: 1.6mm; Width: 0.8mm; Height: 0.45mm; Depth: 0.8mm; Radiation Hardening: No; REACH SVHC: No SVHC; RoHS Compliant: Yes; Military Standard: Not; Lead Free: Lead Free; ComponentLink1URL: https://datasheet.ciiva.com/34303/1987450-34303565.pdf?src-supplier=Jameco; ComponentLink1Description: https://datasheet.ciiva.com/34303/1987450-34303565.pdf?src-supplier=Jameco; ComponentLink2URL: https://datasheet.ciiva.com/7830/aoa0000ce2-7830728.pdf?src-supplier=Element14; ComponentLink2Description: https://datasheet.ciiva.com/7830/aoa0000ce2-7830728.pdf?src-supplier=Element14; ComponentLink3URL: https://datasheet.ciiva.com/46372/1678782-46372726.pdf?src-supplier=Element14; ComponentLink3Description: https://datasheet.ciiva.com/46372/1678782-46372726.pdf?src-supplier=Element14; ComponentLink4URL: https://datasheet.ciiva.com/22667/1678782-22667887.pdf?src-supplier=Element14; ComponentLink4Description: https://datasheet.ciiva.com/22667/1678782-22667887.pdf?src-supplier=Element14; ComponentLink5URL: https://datasheet.ciiva.com/46372/1678782-46372727.pdf?src-supplier=Element14; ComponentLink5Description: https://datasheet.ciiva.com/46372/1678782-46372727.pdf?src-supplier=Element14; ComponentLink6URL: https://datasheet.ciiva.com/24159/aoa0000ce2-24159753.pdf?src-supplier=Mouser; ComponentLink6Description: https://datasheet.ciiva.com/24159/aoa0000ce2-24159753.pdf?src-supplier=Mouser; ComponentLink7URL: https://datasheet.ciiva.com/16762/70260748-16762666.pdf?src-supplier=Allied+Electronics; ComponentLink7Description: https://datasheet.ciiva.com/16762/70260748-16762666.pdf?src-supplier=Allied+Electronics; ComponentLink8URL: https://datasheet.ciiva.com/16765/70260748-16765766.pdf?src-supplier=Allied+Electronics; ComponentLink8Description: https://datasheet.ciiva.com/16765/70260748-16765766.pdf?src-supplier=Allied+Electronics; ComponentLink9URL: https://datasheet.ciiva.com/9186/aoa0000ce2-9186725.pdf?src-supplier=Avnet; ComponentLink9Description: https://datasheet.ciiva.com/9186/aoa0000ce2-9186725.pdf?src-supplier=Avnet; ComponentLink10URL: https://datasheet.ciiva.com/48530/aoa0000ce2-48530986.pdf?src-supplier=Avnet; ComponentLink10Description: https://datasheet.ciiva.com/48530/aoa0000ce2-48530986.pdf?src-supplier=Avnet; ComponentLink11URL: https://datasheet.ciiva.com/30088/aoa0000ce2-30088649.pdf?src-supplier=Onlinecomponents.com; ComponentLink11Description: https://datasheet.ciiva.com/30088/aoa0000ce2-30088649.pdf?src-supplier=Onlinecomponents.com; ComponentLink12URL: https://datasheet.ciiva.com/17207/aoa0000ce2-17207983.pdf?src-supplier=Avnet+Europe; ComponentLink12Description: https://datasheet.ciiva.com/17207/aoa0000ce2-17207983.pdf?src-supplier=Avnet+Europe

## Sheet OLED.SchDoc
size A4; SheetNumber: 5; SheetTotal: 7
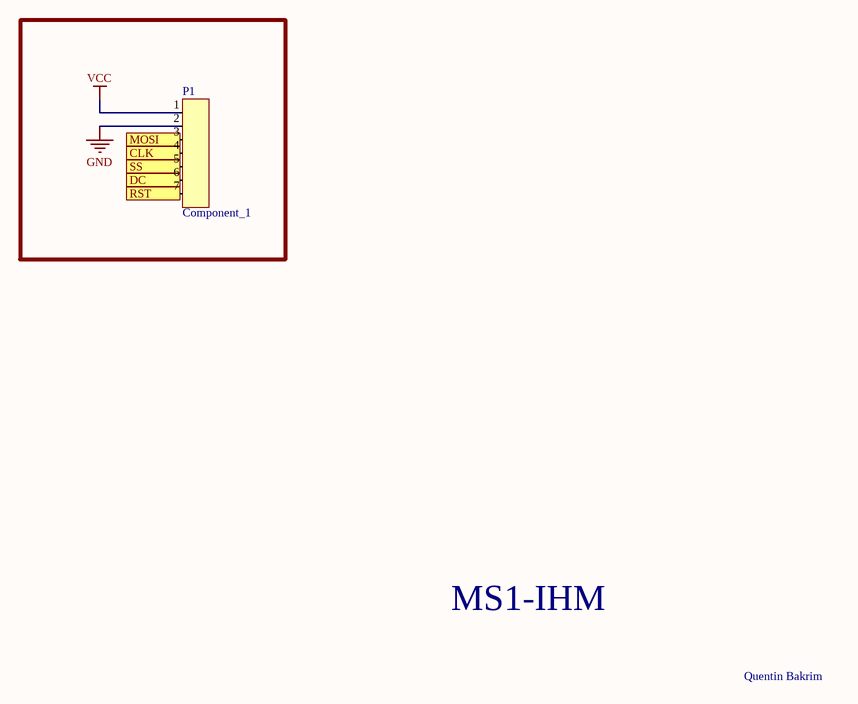
[diagram p4: OLED.SchDoc]

### Parts
P1  Component_1

### Ports
CLK, DC, MOSI, RST, SS

### Nets
GND: P1.2
VCC: P1.1
NetP1_3: P1.3 ; port MOSI
NetP1_4: P1.4 ; port CLK
NetP1_5: P1.5 ; port SS
NetP1_6: P1.6 ; port DC
NetP1_7: P1.7 ; port RST

### Notes on the sheet
- MS1-IHM
- Quentin Bakrim

## Sheet SUPPLY.SchDoc
size A4; SheetNumber: 6; SheetTotal: 7
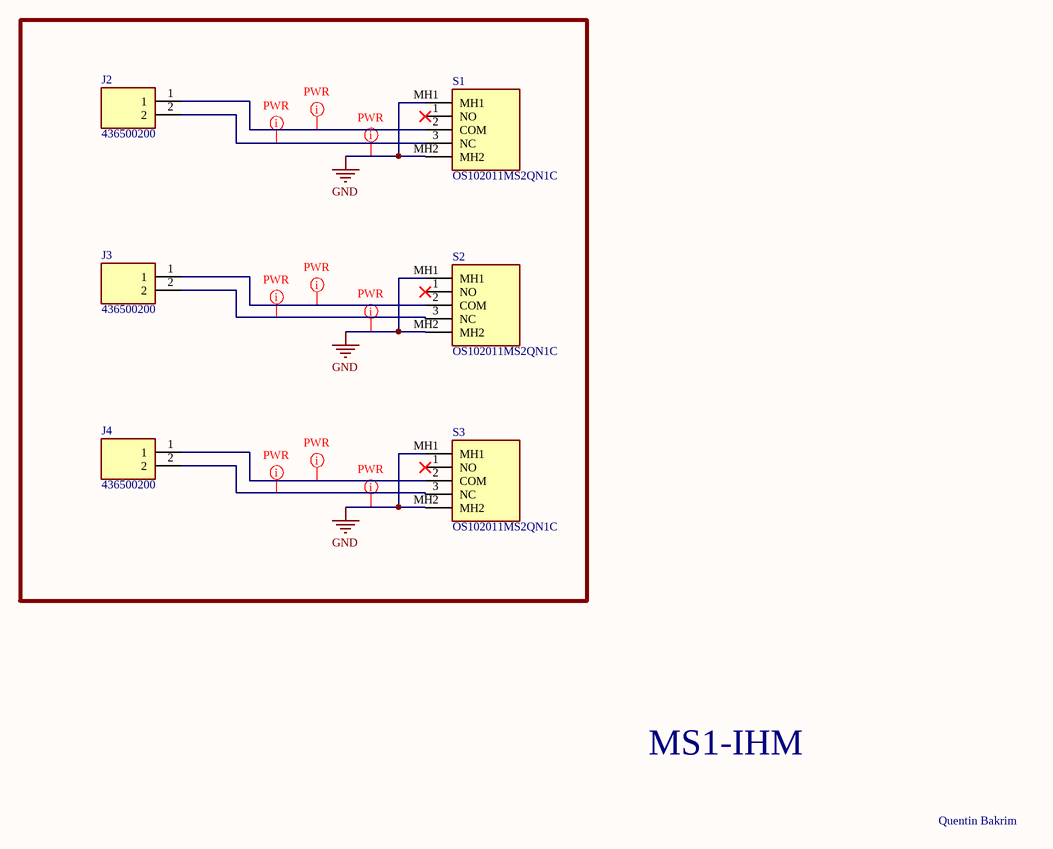
[diagram p5: SUPPLY.SchDoc]

### Parts
J2  436500200  [MOLEX_436500200]
J3  436500200  [MOLEX_436500200]
J4  436500200  [MOLEX_436500200]
S1  OS102011MS2QN1C  [OS102011MS2QN1C]
S2  OS102011MS2QN1C  [OS102011MS2QN1C]
S3  OS102011MS2QN1C  [OS102011MS2QN1C]

### Nets
GND: S1.MH1 S1.MH2 S2.MH1 S2.MH2 S3.MH1 S3.MH2
NetJ2_1: J2.1 S1.2(COM)
NetJ2_2: J2.2 S1.3(NC)
NetJ3_1: J3.1 S2.2(COM)
NetJ3_2: J3.2 S2.3(NC)
NetJ4_1: J4.1 S3.2(COM)
NetJ4_2: J4.2 S3.3(NC)

Not connected (* = marked no-connect by the designer): S1 1(NO)*; S2 1(NO)*; S3 1(NO)*

### Layout directives
net class PWR: (no net found under the mark), GND, NetJ2_1, NetJ2_2, NetJ3_1, NetJ3_2, NetJ4_1, NetJ4_2

### Notes on the sheet
- MS1-IHM
- Quentin Bakrim

### Library data of the parts
J2-J4 = 436500200: MF: {'manufacturer': u'Molex'}; MP: 436500200; Availability: Unavailable; Price: None; Value: *; Package: None
S1-S3 = OS102011MS2QN1C: Switch; Manufacturer_Name: C & K COMPONENTS; Datasheet Link: http://uk.rs-online.com/web/p/products/1546147; Height: 8.7mm; Manufacturer_Part_Number: OS102011MS2QN1C; Mouser Part Number: 611-OS102011MS2QN1C; Mouser Price/Stock: https://www.mouser.co.uk/ProductDetail/CK/OS102011MS2QN1C?qs=FgXbtR4Gg7KP4hs8ueQ7Wg%3D%3D

## Sheet CONN SEQ.SchDoc
size A; SheetNumber: 7; SheetTotal: 7
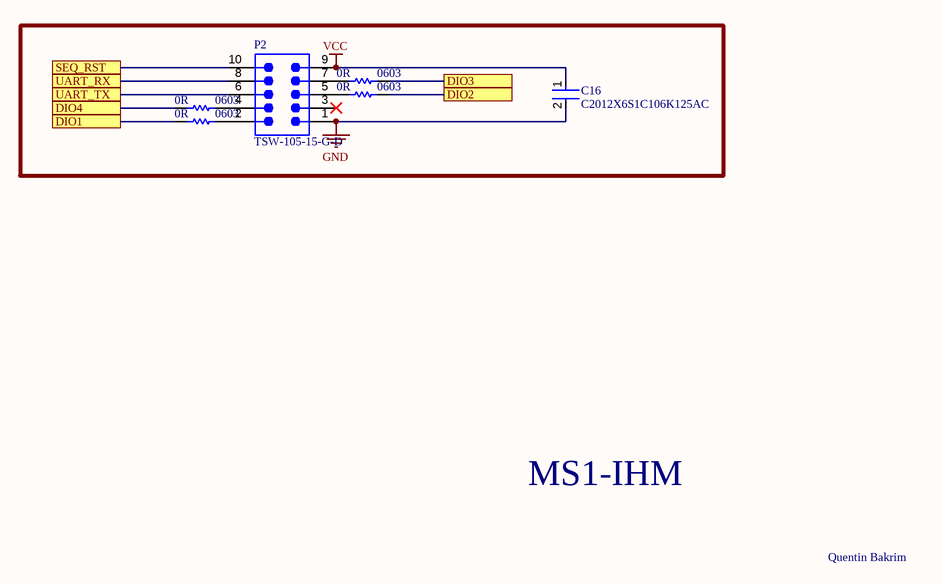
[diagram p6: CONN SEQ.SchDoc]

### Parts
C16  C2012X6S1C106K125AC  [FP-C2012-125-0_2-MFG]
P2  TSW-105-15-G-D  [SMTC-TSW-105-15-X-D]
R46  PackageReference: 0603  Resistor: 0R  [RESC1609X50X30NL8T20]  (hidden comment: CRCW06030000Z0EA)
R47  PackageReference: 0603  Resistor: 0R  [RESC1609X50X30NL8T20]  (hidden comment: CRCW06030000Z0EA)
R48  PackageReference: 0603  Resistor: 0R  [RESC1609X50X30NL8T20]  (hidden comment: CRCW06030000Z0EA)
R49  PackageReference: 0603  Resistor: 0R  [RESC1609X50X30NL8T20]  (hidden comment: CRCW06030000Z0EA)

### Ports
DIO1, DIO2, DIO3, DIO4, SEQ_RST, UART_RX, UART_TX

### Nets
GND: C16.2 P2.1
VCC: C16.1 P2.9
NetC3_1: R49.1 ; port DIO1
NetC6_1: R47.2 ; port DIO2
NetC7_1: R46.2 ; port DIO3
NetC8_1: R48.1 ; port DIO4
NetP2_2: P2.2 R49.2
NetP2_4: P2.4 R48.2
NetP2_5: P2.5 R47.1
NetP2_6: P2.6 ; port UART_TX
NetP2_7: P2.7 R46.1
NetP2_8: P2.8 ; port UART_RX
NetP2_10: P2.10 ; port SEQ_RST

Not connected (* = marked no-connect by the designer): P2 3*

### Notes on the sheet
- MS1-IHM
- Quentin Bakrim

### Library data of the parts
C16 = CMP-08246-003655-1: as C15 on sheet STM32; Contact Plating: Tin; Height: 1.25mm; Thickness: 0.057inch; Case Code (Metric): 2012; Dielectric Material: Ceramic; Tolerance: 10%; Depth: 1.25mm; Length: 2mm; Lead Free: Lead Free; RoHS Compliant: Yes; Case/Package: 0805; REACH SVHC: No SVHC; Construction: Flat; Voltage Rating: 16V; Max Operating Temperature: 105°C; Series: C; Width: 0.049inch; Voltage Rating (DC): 16V; Packaging: Tape and Reel; Package Quantity: 1; Min Operating Temperature: -55°C; Mount: Surface Mount; Dielectric: X6S; Case Code (Imperial): 0805
P2 = CMP-1024-00369-1: 0.025" SQ Post Header, Through-hole, Vertical, -55 to 125 degC, 2.54 mm Pitch, 10-Pin, Male, RoHS; Manufacturer: Samtec; Pitch: 2.54 mm; ComponentLink2Description: Datasheet; ComponentLink1URL: http://www.samtec.com; DatasheetVersion: F-214; ComponentLink3Description: Package Specification; PartNumber: TSW-105-15-G-D; RoHS: True; Temperature Range: -55 to 125 degC; ComponentLink3URL: http://www.samtec.com/documents/webfiles/cpdf/TSW-XXX-XX-XXX-X-XX-XXX-MKT.pdf; Orientation: Vertical; Mounting Technology: Through-hole; PackageReference: TSW-105-15-X-D; PackageVersion: DM, 8/1988; PackageDescription: .025[0.64] SQ. Post Terminal Strip Assembly; ComponentLink2URL: http://www.samtec.com/documents/webfiles/pdf/TSW_TH.PDF; ComponentLink1Description: Manufacturer URL
R46-R49 = CMP-2000-03816-5: as R17 on sheet STM32; Package Quantity: 5000; DatasheetVersion: 06/2012; Min Operating Temperature: -55 degC; ComponentLink1URL: http://www.vishay.com/; Mounting Technology: Surface Mount; Height: 0.45 mm; ComponentLink1Description: Manufacturer URL; REACH SVHC: Unknown; Packaging: Tape and Reel; Max Operating Temperature: 155 degC; Mount: Surface Mount; ComponentLink2Description: Datasheet; PackageDescription: 2-Pin Surface Mount Device, Body 1.575 x 0.85 mm; Length: 1.55 mm; ComponentLink2URL: http://www.vishay.com/docs/20035/dcrcwe3.pdf; Pins: 2; RoHSCompliant: true

## Nets that join several sheets
GND: BTN (16 pins), STM32 (16 pins), OLED (P1.2), SUPPLY (6 pins), CONN SEQ (C16.2 P2.1)
VCC: BTN (16 pins), STM32 (17 pins), LED (5 pins), OLED (P1.1), CONN SEQ (C16.1 P2.9)
NetC1_1: BTN (C1.1 R1.2), STM32 (U1.56)
NetC2_1: BTN (C2.1 R2.2), STM32 (U1.58)
NetC3_1: BTN (C3.1 R3.2), CONN SEQ (R49.1)
NetC4_1: BTN (C4.1 R7.2), STM32 (U1.57)
NetC5_1: BTN (C5.1 R8.2), STM32 (U1.59)
NetC6_1: BTN (C6.1 R9.2), CONN SEQ (R47.2)
NetC7_1: BTN (C7.1 R13.2), CONN SEQ (R46.2)
NetC8_1: BTN (C8.1 R14.2), CONN SEQ (R48.1)
NetP1_3: STM32 (R25.1), OLED (P1.3)
NetP1_4: STM32 (R22.1), OLED (P1.4)
NetP1_5: STM32 (R20.1 R?#1.1), OLED (P1.5)
NetP1_6: STM32 (R23.1), OLED (P1.6)
NetP1_7: STM32 (R21.2 R?#2.1), OLED (P1.7)
NetP2_6: STM32 (R18.1), CONN SEQ (P2.6)
NetP2_8: STM32 (R19.1), CONN SEQ (P2.8)
NetP2_10: STM32 (R17.1), CONN SEQ (P2.10)
NetR31_1: STM32 (U1.43), LED (R31.1)
NetR32_1: STM32 (U1.45), LED (R32.1)
NetR33_1: STM32 (U1.44), LED (R33.1)
NetR34_1: STM32 (U1.40), LED (R34.1)
NetR35_1: STM32 (U1.42), LED (R35.1)
NetR36_1: STM32 (U1.41), LED (R36.1)
NetR37_1: STM32 (U1.37), LED (R37.1)
NetR38_1: STM32 (U1.39), LED (R38.1)
NetR39_1: STM32 (U1.38), LED (R39.1)
NetR40_1: STM32 (U1.8), LED (R40.1)
NetR41_1: STM32 (U1.10), LED (R41.1)
NetR42_1: STM32 (U1.9), LED (R42.1)
NetR43_1: STM32 (U1.2), LED (R43.1)
NetR44_1: STM32 (U1.4), LED (R44.1)
NetR45_1: STM32 (U1.3), LED (R45.1)